# EAGLE schematic OttoPi04 (EAGLE 9.6.0)
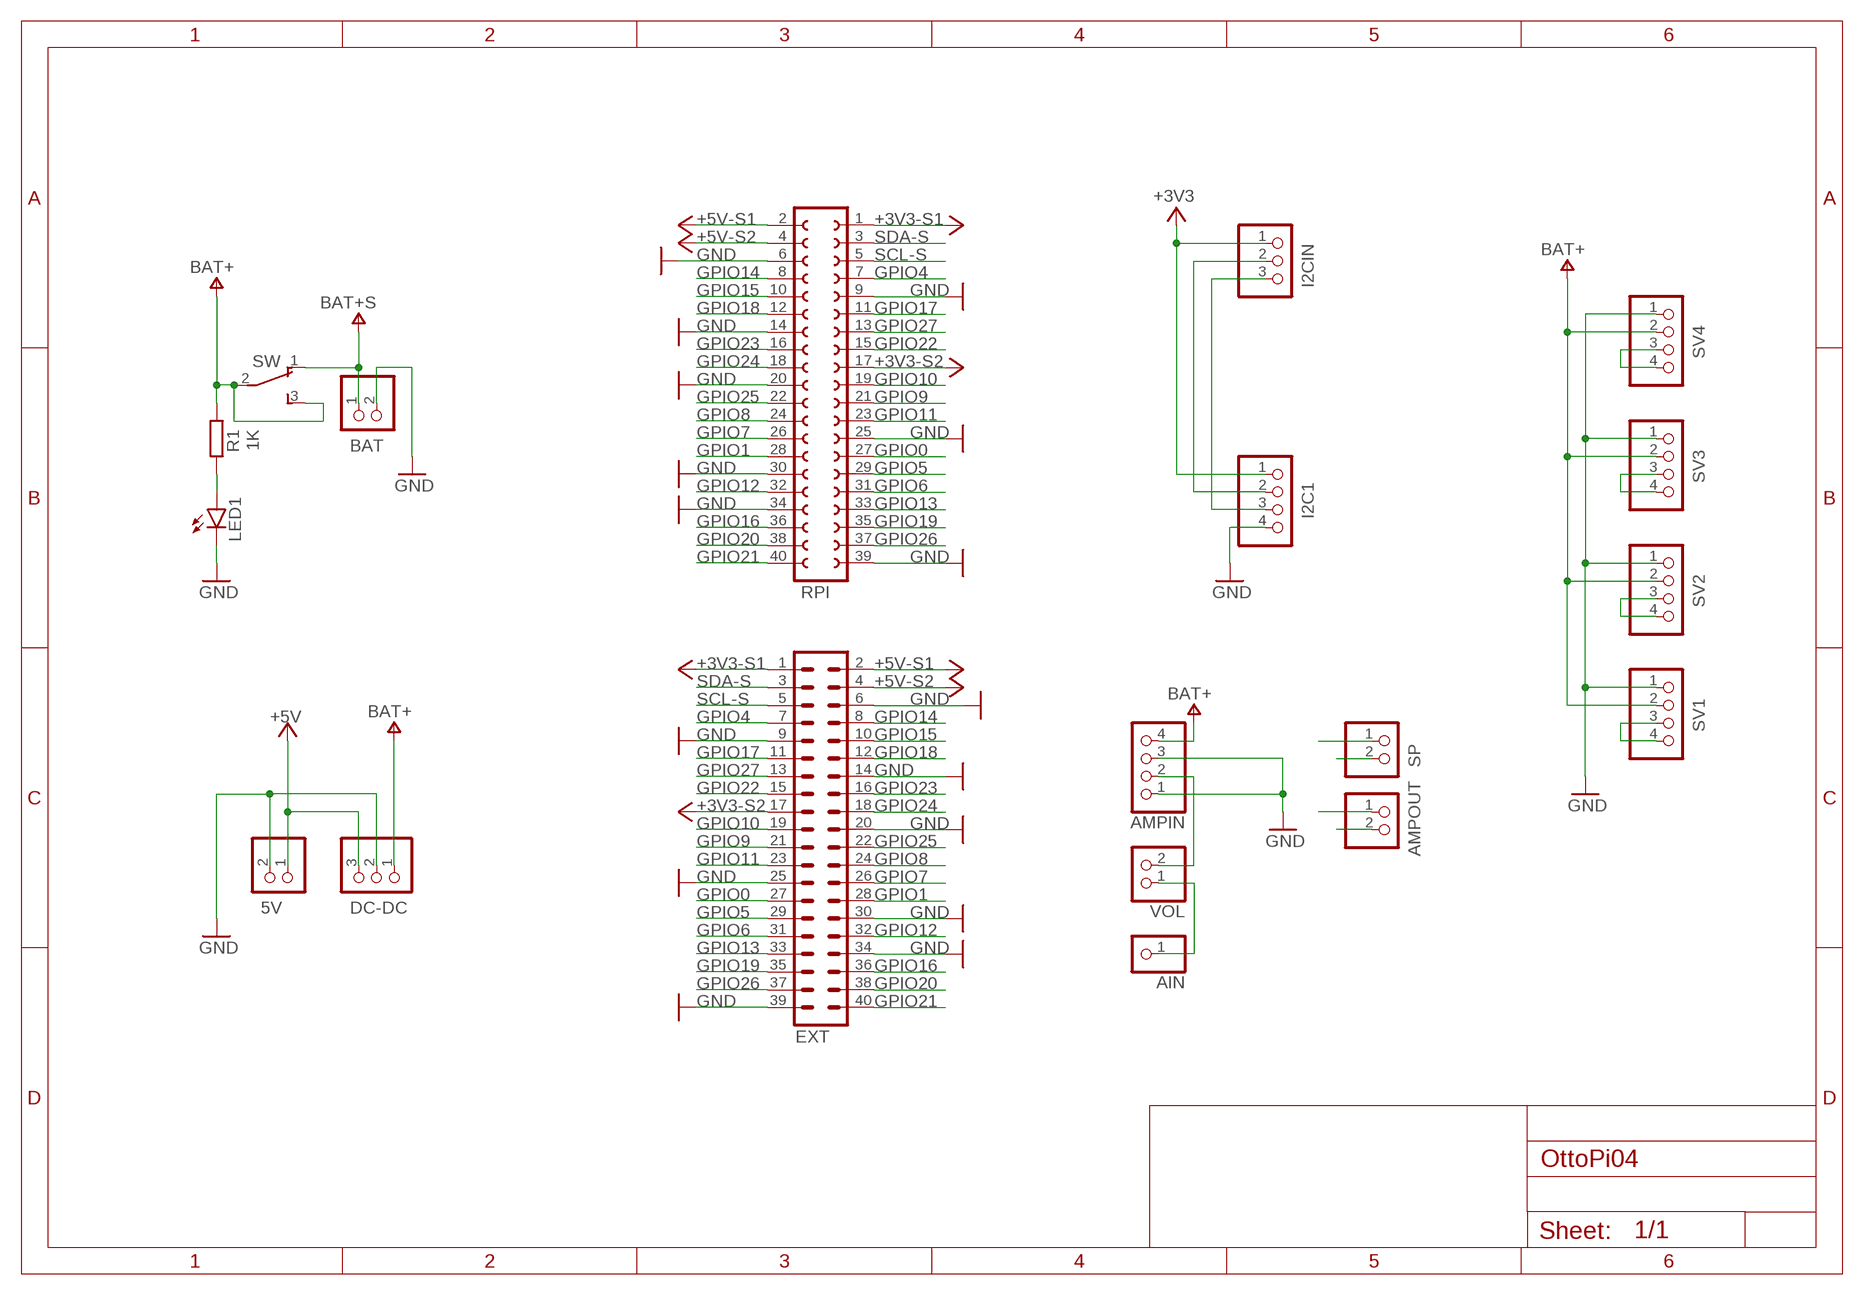
[diagram p0: schematic, sheet 1]

## Parts
5V  PINHD-1X2  [1X02]
AIN  PINHD-1X1  [1X01]
AMPIN  PINHD-1X4  [1X04]
AMPOUT  PINHD-1X2  [1X02]
BAT  JST_2PIN-THM  [JST-PH-2-THM]
DC-DC  PINHD-1X3  [1X03]
EXT  MA20-2W  [MA20-2W]
I2C1  PINHD-1X4  [1X04]
I2CIN  PINHD-1X3  [1X03]
LED1  LED3MM  [LED3MM]
R1  1K  R-EU_0204/7  [0204/7]
RPI  FE20-2  [FE20-2]
SP  PINHD-1X2  [1X02]
SV1  PINHD-1X4  [1X04]
SV2  PINHD-1X4  [1X04]
SV3  PINHD-1X4  [1X04]
SV4  PINHD-1X4  [1X04]
SW  TL36PO  [TL3XPO]
VOL  PINHD-1X2  [1X02]

## Nets
+3V3: I2C1.1 I2CIN.1
+3V3-S1: EXT.1 RPI.1 ; supply symbol labelled +3V3
+3V3-S2: EXT.17 RPI.17 ; supply symbol labelled +3V3
+4V_S: BAT.1 SW.1(O) ; supply symbol labelled BAT+S
+5V: 5V.1 DC-DC.3
+5V-S1: EXT.2 RPI.2 ; supply symbol labelled +5V
+5V-S2: EXT.4 RPI.4 ; supply symbol labelled +5V
AIN1: AIN.1 VOL.1
AIN2: AMPIN.2 VOL.2
BAT+: AMPIN.4 DC-DC.1 R1.2 SV1.2 SV2.2 SV3.2 SV4.2 SW.2(P) SW.3(S)
GND: 5V.2 AMPIN.1 AMPIN.3 BAT.2 DC-DC.2 EXT.6 EXT.9 EXT.14 EXT.20 EXT.25 EXT.30 EXT.34 EXT.39 I2C1.4 LED1.K(C) RPI.6 RPI.9 RPI.14 RPI.20 RPI.25 RPI.30 RPI.34 RPI.39 SV1.1 SV2.1 SV3.1 SV4.1
GPIO0: EXT.27 RPI.27
GPIO1: EXT.28 RPI.28
GPIO4: EXT.7 RPI.7
GPIO5: EXT.29 RPI.29
GPIO6: EXT.31 RPI.31
GPIO7: EXT.26 RPI.26
GPIO8: EXT.24 RPI.24
GPIO9: EXT.21 RPI.21
GPIO10: EXT.19 RPI.19
GPIO11: EXT.23 RPI.23
GPIO12: EXT.32 RPI.32
GPIO13: EXT.33 RPI.33
GPIO14: EXT.8 RPI.8
GPIO15: EXT.10 RPI.10
GPIO16: EXT.36 RPI.36
GPIO17: EXT.11 RPI.11
GPIO18: EXT.12 RPI.12
GPIO19: EXT.35 RPI.35
GPIO20: EXT.38 RPI.38
GPIO21: EXT.40 RPI.40
GPIO22: EXT.15 RPI.15
GPIO23: EXT.16 RPI.16
GPIO24: EXT.18 RPI.18
GPIO25: EXT.22 RPI.22
GPIO26: EXT.37 RPI.37
GPIO27: EXT.13 RPI.13
LED: LED1.A R1.1
N$1: AMPOUT.1
N$2: AMPOUT.2
SCL: I2C1.3 I2CIN.3
SCL-S: EXT.5 RPI.5
SDA-S: EXT.3 RPI.3
SDL: I2C1.2 I2CIN.2
SP+: SP.1
SP-: SP.2
SV1: SV1.3 SV1.4
SV2: SV2.3 SV2.4
SV3: SV3.3 SV3.4
SV4: SV4.3 SV4.4

## Library data of the parts
5V AMPOUT SP VOL = pinhead:PINHD-1X2: PIN HEADER
AIN = pinhead:PINHD-1X1: PIN HEADER
AMPIN I2C1 SV1-SV4 = pinhead:PINHD-1X4: PIN HEADER
BAT = adafruit:JST_2PIN: JST 2-Pin Connectors of various flavors SMT-RA (S2B-PH-SM4) 4UConnector #17311 SMT (B2B-PH-SM4) THM-RA (S2B-PH) THM (B2B-PH)
DC-DC I2CIN = pinhead:PINHD-1X3: PIN HEADER
EXT = con-lstb:MA20-2W: PIN HEADER; OC_FARNELL: unknown; OC_NEWARK: unknown
LED1 = led:LED: LED OSRAM: - CHIPLED LG R971, LG N971, LY N971, LG Q971, LY Q971, LO R971, LY R971 LH N974, LH R974 LS Q976, LO Q976, LY Q976 LO Q996 - Hyper CHIPLED LW Q18S LB Q993, LB Q99A, LB R99A - SideLED LS A670, LO A670, LY A670, LG A670, LP A670 LB A673, LV A673, LT A673, LW A673 LH A674 LY A675 LS A676, LA A676, LO A676, LY A676, LW A676 LS A679, LY A679, LG A679 - Hyper Micro SIDELED® LS Y876, LA Y876, LO Y876, LY Y876 LT Y87S - SmartLED LW L88C, LW L88S LB L89C, LB L89S, LG L890 LS L89K, LO L89K, LY L89K LS L896, LA L896, LO L896, LY L896 - TOPLED LS T670, LO T670, LY T670, LG T670, LP T670 LSG T670, LSP T670, LSY T670, LOP T670, LYG T670 LG T671, LOG T671, LSG T671 LB T673, LV T673, LT T673, LW T673 LH T674 LS T676, LA T676, LO T676, LY T676, LB T676, LH T676, LSB T676, LW T676 LB T67C, LV T67C, LT T67C, LS T67K, LO T67K, LY T67K, LW E67C LS E67B, LA E67B, LO E67B, LY E67B, LB E67C, LV E67C, LT E67C LW T67C LS T679, LY T679, LG T679 LS T770, LO T770, LY T770, LG T770, LP T770 LB T773, LV T773, LT T773, LW T773 LH T774 LS E675, LA E675, LY E675, LS T675 LS T776, LA T776, LO T776, LY T776, LB T776 LHGB T686 LT T68C, LB T68C - Hyper Mini TOPLED® LB M676 - Mini TOPLED Santana® LG M470 LS M47K, LO M47K, LY M47K Source: http://www.osram.convergy.de LUXEON: - LUMILED® LXK2-PW12-R00, LXK2-PW12-S00, LXK2-PW14-U00, LXK2-PW14-V00 LXK2-PM12-R00, LXK2-PM12-S00, LXK2-PM14-U00 LXK2-PE12-Q00, LXK2-PE12-R00, LXK2-PE12-S00, LXK2-PE14-T00, LXK2-PE14-U00 LXK2-PB12-K00, LXK2-PB12-L00, LXK2-PB12-M00, LXK2-PB14-N00, LXK2-PB14-P00, LXK2-PB14-Q00 LXK2-PR12-L00, LXK2-PR12-M00, LXK2-PR14-Q00, LXK2-PR14-R00 LXK2-PD12-Q00, LXK2-PD12-R00, LXK2-PD12-S00 LXK2-PH12-R00, LXK2-PH12-S00 LXK2-PL12-P00, LXK2-PL12-Q00, LXK2-PL12-R00 Source: www.luxeon.com KINGBRIGHT: KA-3528ASYC Source: www.kingbright.com
R1 = rcl:R-EU_: RESISTOR, European symbol; SPICEPREFIX: R
RPI = con-lsta:FE20-2: FEMALE HEADER; OC_FARNELL: unknown; OC_NEWARK: unknown
SW = switch:TL36PO: TINY SWITCH ON - ON Source: http://www2.produktinfo.conrad.com/datenblaetter/700000-724999/705152-da-01-de-Subminiaturschalter_TL_36YO.pdf

## Net classes
0 default: clearance 0.254 mm
1 V+: width 0.1 mm